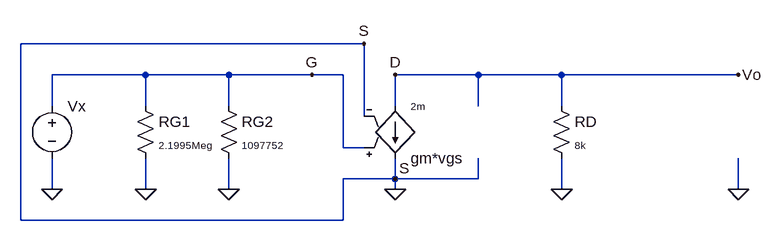
[diagram p0: schematic nmos_small_signal_RIN.asc]
nmos_small_signal_RIN.asc, the LTspice schematic file:
Version 4
SHEET 1 1008 680
WIRE 384 16 -144 16
WIRE 48 64 -96 64
WIRE 176 64 48 64
WIRE 304 64 176 64
WIRE 352 64 304 64
WIRE 560 64 432 64
WIRE 688 64 560 64
WIRE 960 64 688 64
WIRE -96 112 -96 64
WIRE 48 112 48 64
WIRE 176 112 176 64
WIRE 432 112 432 64
WIRE 560 112 560 64
WIRE 688 112 688 64
WIRE 384 128 384 16
WIRE 352 176 352 64
WIRE 384 176 352 176
WIRE 432 224 432 192
WIRE 432 224 352 224
WIRE 560 224 560 192
WIRE 560 224 432 224
WIRE -96 240 -96 192
WIRE 48 240 48 192
WIRE 176 240 176 192
WIRE 432 240 432 224
WIRE 688 240 688 192
WIRE 960 240 960 192
WIRE -144 288 -144 16
WIRE 352 288 352 224
WIRE 352 288 -144 288
FLAG -96 240 0
FLAG 48 240 0
FLAG 176 240 0
FLAG 432 240 0
FLAG 688 240 0
FLAG 960 240 0
FLAG 432 64 D
FLAG 960 64 Vo
FLAG 304 64 G
FLAG 432 224 S
FLAG 384 16 S
SYMBOL voltage -96 96 R0
WINDOW 3 24 96 Invisible 2
SYMATTR InstName Vx
SYMBOL res 32 96 R0
WINDOW 3 36 76 Left 1
SYMATTR Value 2.1995Meg
SYMATTR InstName RG1
SYMBOL res 160 96 R0
WINDOW 3 36 76 Left 1
SYMATTR Value 1097752
SYMATTR InstName RG2
SYMBOL res 672 96 R0
WINDOW 3 36 76 Left 1
SYMATTR Value 8k
SYMATTR InstName RD
SYMBOL g 432 208 M180
WINDOW 3 24 96 Left 1
SYMATTR Value 2m
SYMATTR InstName gm*vgs

The netlist it stands for:
* nmos_small_signal_RIN.asc
Vx G 0 V
RG1 G 0 2.1995Meg
RG2 G 0 1097752
RD Vo 0 8k
gm*vgs Vo 0 G 0 2m
.backanno
.end